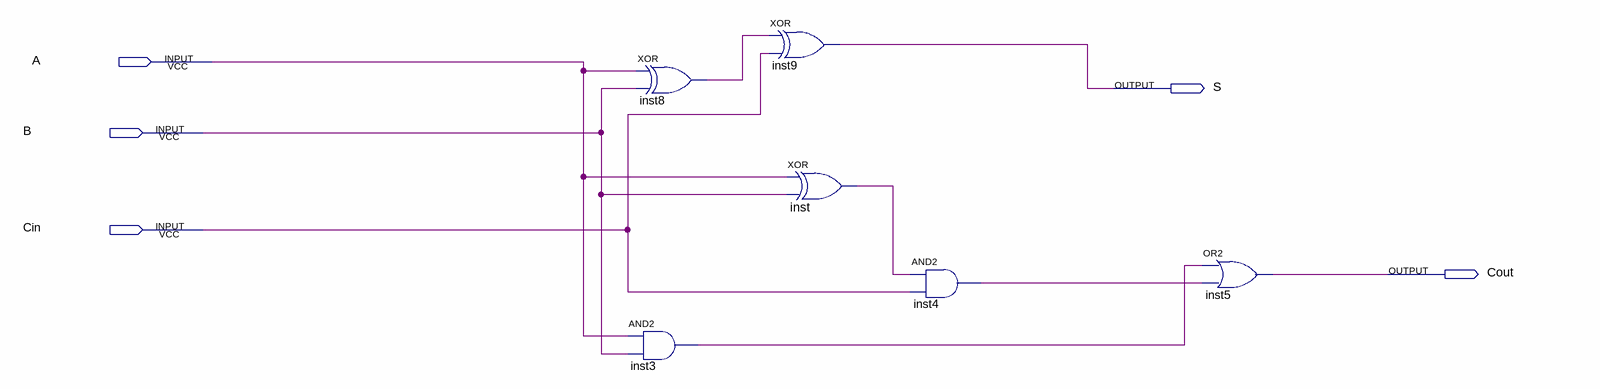
[diagram p0: schematic sheet]
// Quartus schematic somadorCompleto.bdf as structural Verilog: 6 symbols, 5 pins
module somadorCompleto (
  input  A,
  input  B,
  input  Cin,
  output S,
  output Cout
);

  wire inst3_out, inst4_out, inst8_out, inst_out;

  xor inst8 (inst8_out, A, B);
  and inst3 (inst3_out, A, B);
  xor inst9 (S, inst8_out, Cin);
  xor inst (inst_out, A, B);
  and inst4 (inst4_out, inst_out, Cin);
  or inst5 (Cout, inst3_out, inst4_out);
endmodule
